# Altium schematic sheet Rocket_IO_Port.SchDoc
size A4; Organization: Altium Limited; Address1: L3, 12a Rodborough Rd; Address2: Frenchs Forest; Address3: NSW; Address4: Australia 2086; DocumentNumber: 2; Revision: 1.01; SheetNumber: 2; SheetTotal: 3
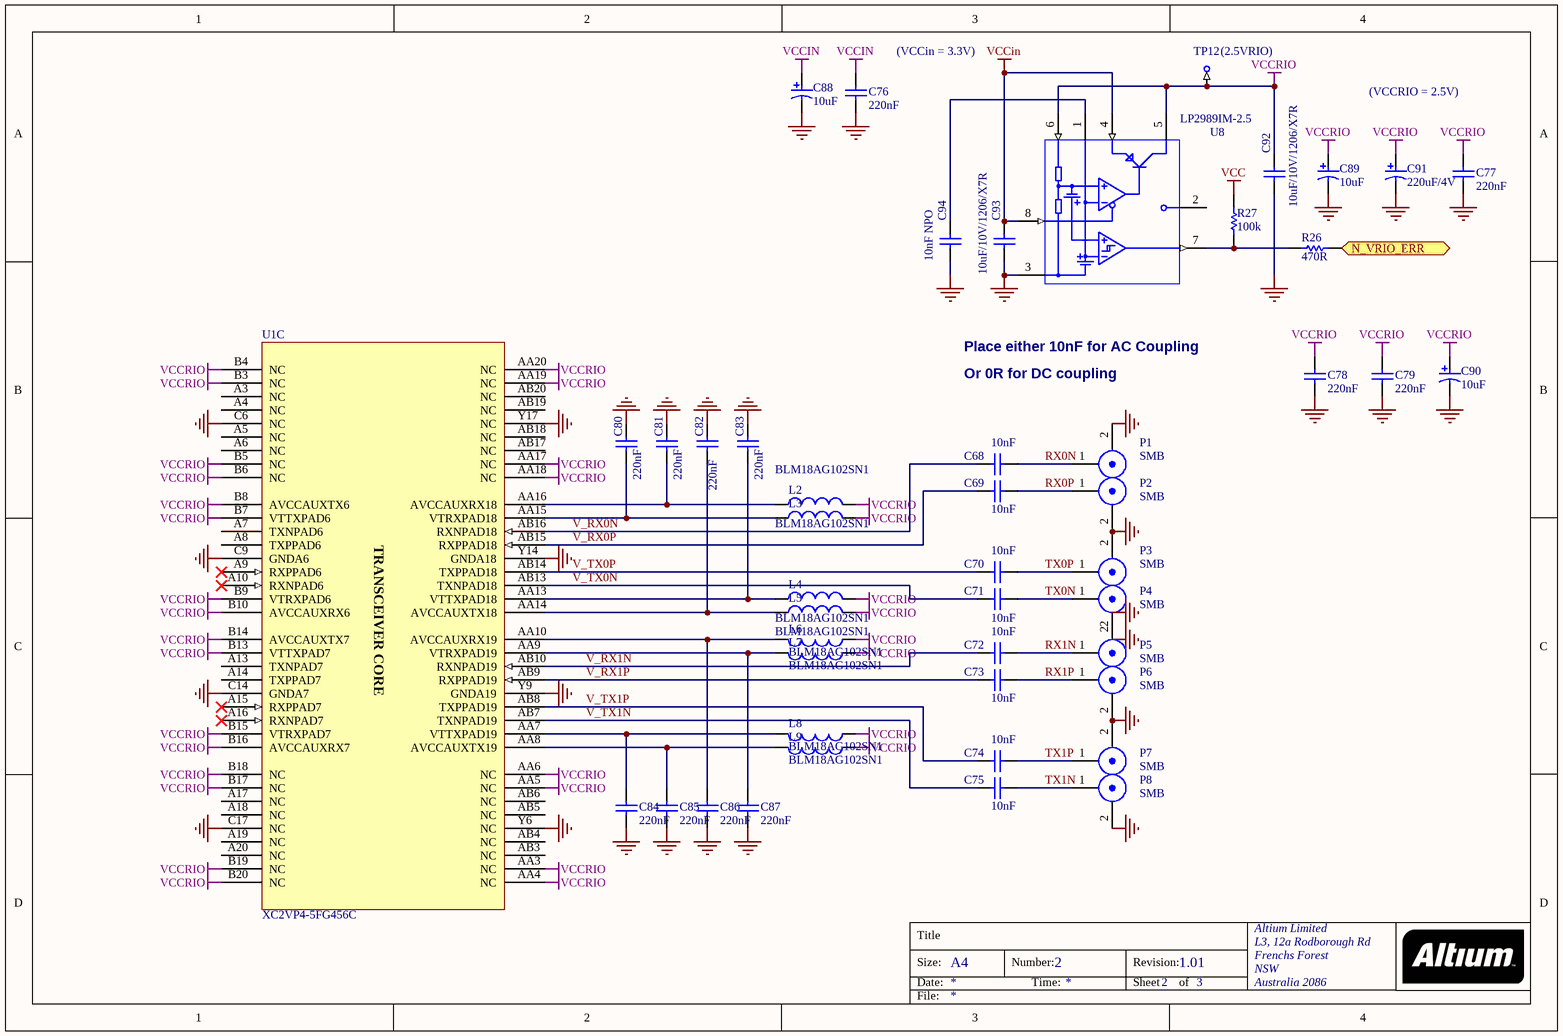
[diagram p0: Rocket_IO_Port.SchDoc]

## Parts
C68  10nF  [CC1005-0402]
C69  10nF  [CC1005-0402]
C70  10nF  [CC1005-0402]
C71  10nF  [CC1005-0402]
C72  10nF  [CC1005-0402]
C73  10nF  [CC1005-0402]
C74  10nF  [CC1005-0402]
C75  10nF  [CC1005-0402]
C76  220nF  [CC1608-0603]
C77  220nF  [CC1608-0603]
C78  220nF  [CC1608-0603]
C79  220nF  [CC1608-0603]
C80  220nF  [CC1608-0603]
C81  220nF  [CC1608-0603]
C82  220nF  [CC1608-0603]
C83  220nF  [CC1608-0603]
C84  220nF  [CC1608-0603]
C85  220nF  [CC1608-0603]
C86  220nF  [CC1608-0603]
C87  220nF  [CC1608-0603]
C88  10uF  [MCCT-B]
C89  10uF  [MCCT-B]
C90  10uF  [MCCT-B]
C91  220uF/4V  [MCCT-D]
C92  10uF/10V/1206/X7R  [CC3216-1206]
C93  10uF/10V/1206/X7R  [CC3216-1206]
C94  10nF NPO  [CC3216-1206]
L2  value BLM18AG102SN1  [CC1608-0603]  (hidden comment: Inductor)
L3  value BLM18AG102SN1  [CC1608-0603]  (hidden comment: Inductor)
L4  value BLM18AG102SN1  [CC1608-0603]  (hidden comment: Inductor)
L5  value BLM18AG102SN1  [CC1608-0603]  (hidden comment: Inductor)
L6  value BLM18AG102SN1  [CC1608-0603]  (hidden comment: Inductor)
L7  value BLM18AG102SN1  [CC1608-0603]  (hidden comment: Inductor)
L8  value BLM18AG102SN1  [CC1608-0603]  (hidden comment: Inductor)
L9  value BLM18AG102SN1  [CC1608-0603]  (hidden comment: Inductor)
P1  SMB  [SMB_V-RJ45]
P2  SMB  [SMB_V-RJ45]
P3  SMB  [SMB_V-RJ45]
P4  SMB  [SMB_V-RJ45]
P5  SMB  [SMB_V-RJ45]
P6  SMB  [SMB_V-RJ45]
P7  SMB  [SMB_V-RJ45]
P8  SMB  [SMB_V-RJ45]
R26  470R  [CC2012-0805]
R27  100k  [CC2012-0805]
TP12  (2.5VRIO)  [TestPin]  (no BOM)
U1  XC2VP4-5FG456C  [FG456]  (part C of 5)
U8  LP2989IM-2.5  [SO-8]

## Ports
N_VRIO_ERR (out)

## Nets
GND: C76.2 C77.2 C78.2 C79.2 C80.1 C81.1 C82.1 C83.1 C84.1 C85.1 C86.1 C87.1 C88.2 C89.2 C90.2 C91.2 C92.1 C93.1 C94.2 P1.2(Y) P2.2(Y) P3.2(Y) P4.2(Y) P5.2(Y) P6.2(Y) P7.2(Y) P8.2(Y) U1.C6(NC) U1.C9(GNDA6) U1.C14(GNDA7) U1.C17(NC) U1.Y6(NC) U1.Y9(GNDA19) U1.Y14(GNDA18) U1.Y17(NC) U8.3(GND)
VCC: R27.2
VCCin: C76.1 C88.1 C93.2 U8.4(INPUT) U8.8(S~{/}/D/)
VCCRIO: C77.1 C78.1 C79.1 C89.1 C90.1 C91.1 C92.2 L2.2 L3.2 L4.2 L5.2 L6.2 L7.2 L8.2 L9.2 TP12.1 U1.AA3(NC) U1.AA4(NC) U1.AA5(NC) U1.AA6(NC) U1.AA17(NC) U1.AA18(NC) U1.AA19(NC) U1.AA20(NC) U1.B3(NC) U1.B4(NC) U1.B5(NC) U1.B6(NC) U1.B7(VTTXPAD6) U1.B8(AVCCAUXTX6) U1.B9(VTRXPAD6) U1.B10(AVCCAUXRX6) U1.B13(VTTXPAD7) U1.B14(AVCCAUXTX7) U1.B15(VTRXPAD7) U1.B16(AVCCAUXRX7) U1.B17(NC) U1.B18(NC) U1.B19(NC) U1.B20(NC) U8.5(OUTPUT) U8.6(SENSE)
N_VRIO_ERR: R26.2 ; port N_VRIO_ERR
RX0N: C68.2 P1.1(X)
RX0P: C69.2 P2.1(X)
RX1N: C72.2 P5.1(X)
RX1P: C73.2 P6.1(X)
TX0N: C71.2 P4.1(X)
TX0P: C70.2 P3.1(X)
TX1N: C75.2 P8.1(X)
TX1P: C74.2 P7.1(X)
V_RX0N: C68.1 U1.AB16(RXNPAD18)
V_RX0P: C69.1 U1.AB15(RXPPAD18)
V_RX1N: C72.1 U1.AB10(RXNPAD19)
V_RX1P: C73.1 U1.AB9(RXPPAD19)
V_TX0N: C71.1 U1.AB13(TXNPAD18)
V_TX0P: C70.1 U1.AB14(TXPPAD18)
V_TX1N: C75.1 U1.AB7(TXNPAD19)
V_TX1P: C74.1 U1.AB8(TXPPAD19)
NetC80_2: C80.2 L3.1 U1.AA15(VTRXPAD18)
NetC81_2: C81.2 L2.1 U1.AA16(AVCCAUXRX18)
NetC82_2: C82.2 L5.1 U1.AA14(AVCCAUXTX18)
NetC83_2: C83.2 L4.1 U1.AA13(VTTXPAD18)
NetC84_2: C84.2 L8.1 U1.AA7(VTTXPAD19)
NetC85_2: C85.2 L9.1 U1.AA8(AVCCAUXTX19)
NetC86_2: C86.2 L6.1 U1.AA10(AVCCAUXRX19)
NetC87_2: C87.2 L7.1 U1.AA9(VTRXPAD19)
NetC94_1: C94.1 U8.1(BYPASS)
NetR26_1: R26.1 R27.1 U8.7(~{ERROR})

Not connected (* = marked no-connect by the designer): U1 A3(NC) A4(NC) A5(NC) A6(NC) A7(TXNPAD6) A8(TXPPAD6) A9(RXPPAD6)* A10(RXNPAD6)* A13(TXNPAD7) A14(TXPPAD7) A15(RXPPAD7)* A16(RXNPAD7)* A17(NC) A18(NC) A19(NC) A20(NC) AB3(NC) AB4(NC) AB5(NC) AB6(NC) AB17(NC) AB18(NC) AB19(NC) AB20(NC); U8 2(N/C)

## Notes on the sheet
- (near C76) (VCCin = 3.3V)
- (VCCRIO = 2.5V)
- Place either 10nF for AC Coupling
- Or 0R for DC coupling
- Title
- Size:
- Date:
- A4
- Number:
- Time:
- Revision:
- Sheet
- of
- File:
- (in symbol XC2VP4-5FG456C, part C) TRANSCEIVER CORE

## Library data of the parts
C68-C87 C92-C94 = CAP: Capacitor
  C68-C75: Supplier: FARNELL; Supplier Code: 578-149
  C76-C87: Supplier: FARNELL; Supplier Code: 335-2020
  C92 C93: Supplier: RS; Supplier Code: 367-3437
  C94: Supplier: FARNELL; Supplier Code: 578-320
C88-C91 = CAP_POLAR: Polar Capacitor; Supplier: FARNELL
  C88-C90: Supplier Code: 967-117
  C91: Supplier Code: 355-1829
P1-P8 = SMB: SMB Straight Connector; Revision: 17-Jul-2002: Re-released for DXP Platform.; Publisher: Altium Limited; Supplier: FARNELL; Supplier Code: 410-8073
R26 R27 = RES: Resistor
TP12 = TestPin
U1 = XC2VP4-5FG456C: Virtex-II Pro Platform FPGA, 456-Ball FBGA, Speed Grade 5, 248 User I/Os, Commercial Grade; Manufacturer Recommendation: Solder pad diameter 0.45mm SMD; Package Information: Latest Revision: ver1.1, Apr-2001; User I/Os: 248 Available; Code - JEDEC: MO-151-AAJ-1; Published: 17-Jul-2002; Revision: 16-Apr-2003: Minor layout changes, TXN/TXP Pins changed from 'Output' to 'HiZ'.  'PROG_B' pin types changed from IO to Input.; Datasheet: Latest Revision: 10-Dec-2003; Package Reference: FG456; Publisher: Altium Limited
U8 = LP2989: NS Micropower/Low Noise 500mA LDO; Supplier: FARNELL; Supplier Code: 360-6478
L2-L9 = Inductor: Published: 8-Jun-2000; Revision: July-2002: Re-released for DXP Platform.; Publisher: Altium Limited; Supplier: Murata; Supplier Code: BLM18AG102SN1